# Altium schematic sheet Control.SchDoc
size A3; SheetNumber: 1; SheetTotal: 7
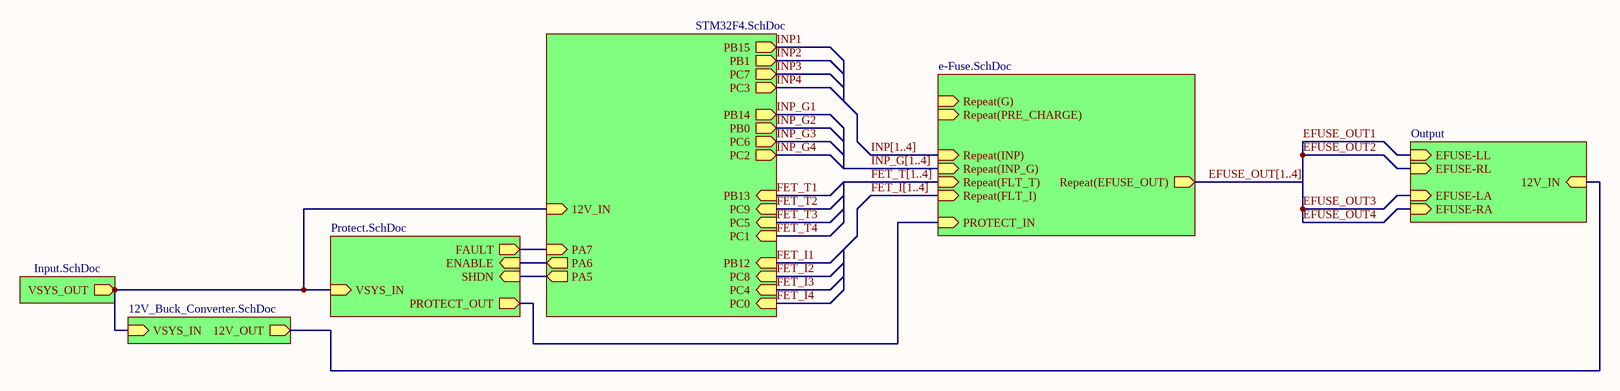
[diagram p0: Control.SchDoc]

## Sub-sheets
Designator = Input.SchDoc: VSYS_OUT (out)
Designator = Protect.SchDoc: VSYS_IN (in), SHDN (in), ENABLE (in), FAULT (out), PROTECT_OUT (out)
Designator = STM32F4.SchDoc: 12V_IN (in), PC0 (in), PC1 (in), PC2 (out), PC3 (out), PC4 (in), PC5 (in), PC6 (out), PC7 (out), PC8 (in), PC9 (in), PB0 (out), PB1 (out), PB12 (in), PB13 (in), PB14 (out), PB15 (out), PA5 (out), PA6 (out), PA7 (in)
Designator = 12V_Buck_Converter.SchDoc: VSYS_IN (in), 12V_OUT (out)
Designator = Output: 12V_IN (in), EFUSE-LL (in), EFUSE-RA (in), EFUSE-RL (in), EFUSE-LA (in)
Repeat(e-Fuse,1, 4) = e-Fuse.SchDoc: PROTECT_IN (in), Repeat(PRE_CHARGE) (in), Repeat(EFUSE_OUT) (out), Repeat(G) (in), Repeat(FLT_I) (in), Repeat(FLT_T) (in), Repeat(INP_G) (in), Repeat(INP) (in)

## Nets
EFUSE_OUT[1..4]: sheet Repeat(e-Fuse,1, 4)/Repeat(EFUSE_OUT)
FET_I1: sheet Designator/PB12
FET_I2: sheet Designator/PC8
FET_I3: sheet Designator/PC4
FET_I4: sheet Designator/PC0
FET_T1: sheet Designator/PB13
FET_T2: sheet Designator/PC9
FET_T3: sheet Designator/PC5
FET_T4: sheet Designator/PC1
INP1: sheet Designator/PB15
INP2: sheet Designator/PB1
INP3: sheet Designator/PC7
INP4: sheet Designator/PC3
INP_G1: sheet Designator/PB14
INP_G2: sheet Designator/PB0
INP_G3: sheet Designator/PC6
INP_G4: sheet Designator/PC2
(unnamed): sheet Designator/VSYS_OUT, sheet Designator/VSYS_IN, sheet Designator/12V_IN, sheet Designator/VSYS_IN
(unnamed): sheet Designator/SHDN, sheet Designator/PA5
(unnamed): sheet Designator/ENABLE, sheet Designator/PA6
(unnamed): sheet Designator/FAULT, sheet Designator/PA7
(unnamed): sheet Designator/PROTECT_OUT, sheet Repeat(e-Fuse,1, 4)/PROTECT_IN
(unnamed): sheet Designator/12V_OUT, sheet Designator/12V_IN

## Buses and harness runs
bus FET_I[1..4]
bus FET_T[1..4]
bus INP[1..4]
bus INP_G[1..4]